# Altium schematic sheet C39832249.SchDoc
size 42 x 27 mm
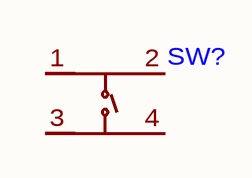
[diagram p0: C39832249.SchDoc]

## Parts
SW?  (no value)  [SW-TH_4P-L4.5-W4.5-P3.00-LS5.5]

## Nets

Not connected (* = marked no-connect by the designer): SW? 1(A) 2(B) 3(C) 4(D)

## Library data of the parts
SW? = 4.5X4.5X5.0WATERPROOF TACT SWITCH DIP 260G